# EAGLE design SOS (EAGLE 9.6.2)
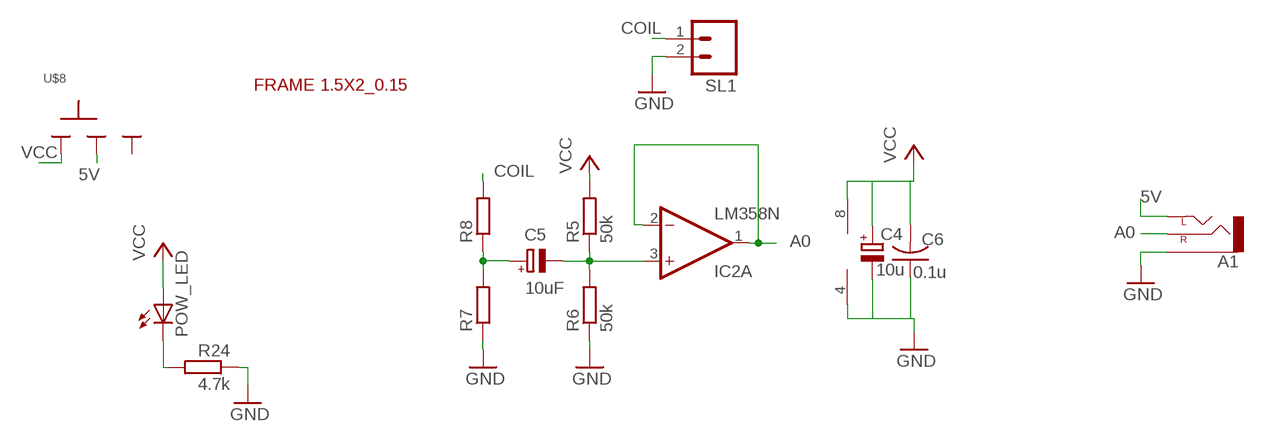
[diagram p0: schematic, sheet 1]

## Parts
A1  AUDIO-JACKPTH  [AUDIO-JACK]
C4  10u  CPOL-EUE2.5-5  [E2,5-5]
C5  10uF  CPOL-EUE2.5-6  [E2,5-6]
C6  0.1u  C-US025-024X044  [C025-024X044]
IC2  LM358N  [DIL08]
POW_LED  LED3MM  [LED3MM]
R5  50k  R-EU_0204/7  [0204/7]
R6  50k  R-EU_0204/7  [0204/7]
R7  R-EU_0204/7  [0204/7]
R8  R-EU_0204/7  [0204/7]
R24  4.7k  R-EU_0204/7  [0204/7]
SL1  M02  [02P]
U$1  FRAME_1.5X2_RAD_0.15  [FRAME_1.5X2_RAD_0.15]
U$8  SLIDESWITCH-BIG  [BIGSWITCH]

## Nets
5V: A1.TIP(LEFT) U$8.2
A0: A1.RING(RIGHT) IC2.1(A:OUT) IC2.2(A:-IN)
CLAMP_SIGNAL: C5.- IC2.3(A:+IN) R5.1 R6.2
COIL: R8.2 SL1.1
GND: A1.SLEEVE C4.- C6.1 IC2.4(P:V-) R6.1 R7.1 R24.1 SL1.2
N$1: C5.+ R7.2 R8.1
N$8: POW_LED.K(C) R24.2
VCC: C4.+ C6.2 IC2.8(P:V+) POW_LED.A R5.2 U$8.1
Unconnected: IC2.5(B:+IN) IC2.6(B:-IN) IC2.7(B:OUT) U$8.3

## Library data of the parts
A1 = CEDT_JANUARY_2015_v6:AUDIO-JACK: 3.5mm Audio Jack Simple 3.5mm common PCB mount audio jack. SKU: PRT-08032
C4 C5 = rcl:CPOL-EU: POLARIZED CAPACITOR, European symbol; SPICEPREFIX: C
C6 = rcl:C-US: CAPACITOR, American symbol; SPICEPREFIX: C
IC2 = CEDT_JANUARY_2015_v5:LM358: OP AMP also LM158; LM258; LM2904 Source: http://cache.national.com/ds/LM/LM158.pdf
POW_LED = CEDT_JANUARY_2015_v6:LED
R5-R8 R24 = rcl:R-EU_: RESISTOR, European symbol; SPICEPREFIX: R
SL1 = CEDT_JANUARY_2015_v6:M02: AMP QUICK CONNECTOR
U$1 = CEDT_JANUARY_2015_v6:FRAME_1.5X2_RAD_0.15
U$8 = CEDT_JANUARY_2015_v6:SLIDESWITCH

## Board
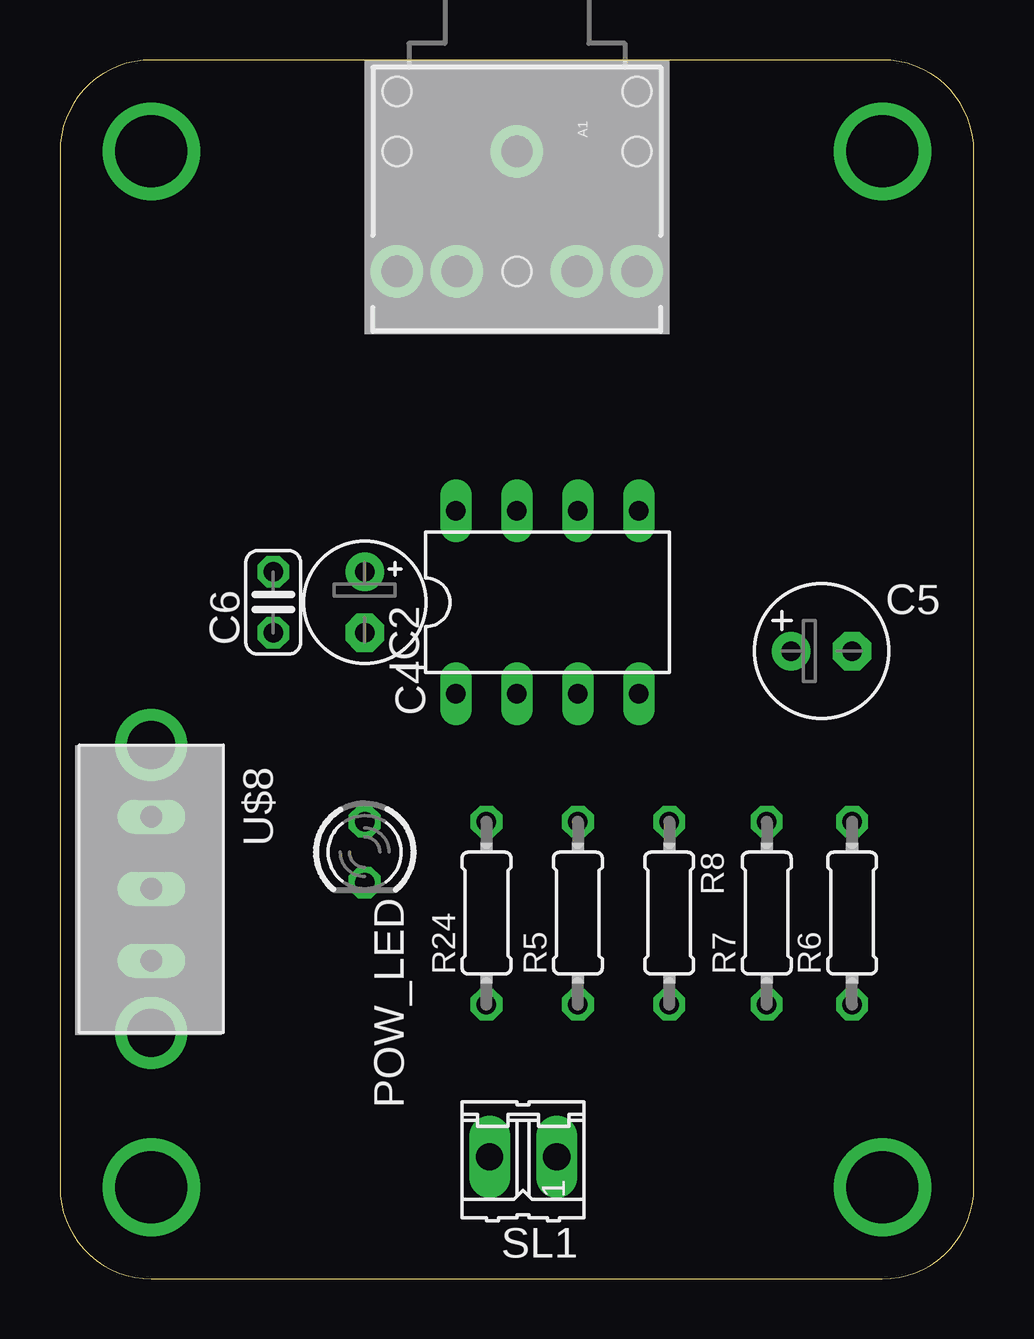
[diagram p1: board, top side]
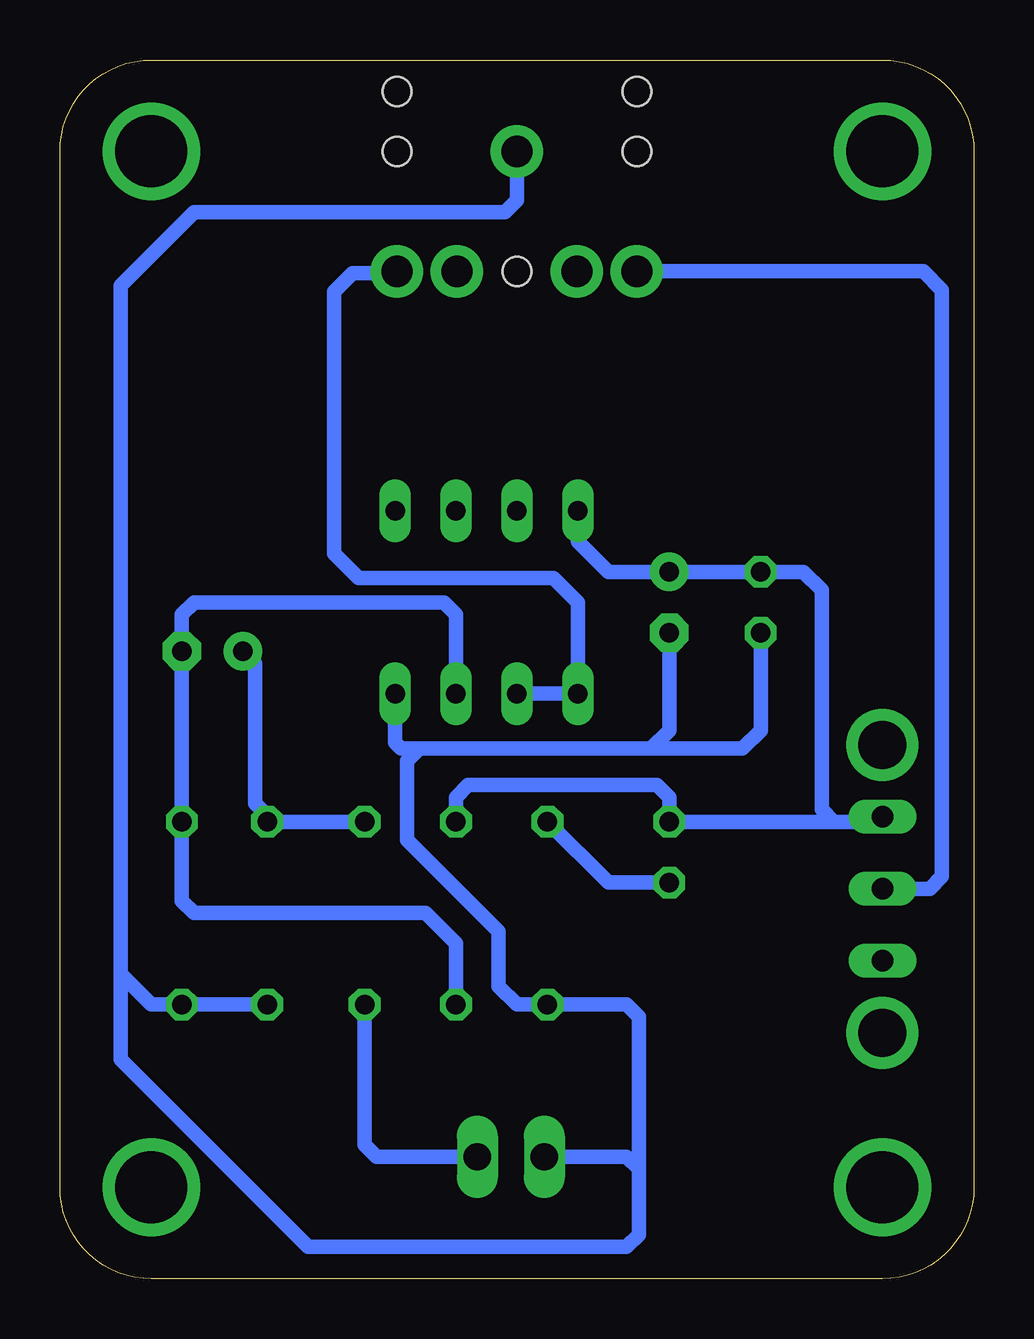
[diagram p2: board, bottom side, seen from below]

Size 38.1 x 50.8 mm. Coordinates in mm from the lower left corner, seen from the top.
Copper layers (1*16): Top 0.035mm / dielectric 1.5mm / Bottom 0.035mm
Design rules "default *": minimum track width 6mil, minimum drill 0.35mm, track to track 16mil, track to pad 16mil, pad to pad 16mil, via to via 16mil, smd to smd 16mil, copper to edge 40mil, drill to drill 6mil, minimum pad ring 10mil, minimum via ring 8mil, stop-mask expansion 4mil, vias tented up to drill 0mil, thermal gap 10mil

### Footprints (pad centres in the part's own frame; a part is rotated, then mirrored left to right if it is on the bottom)
AUDIO-JACK = drill 1.3 pad 2.184: RING 5,5; RSH 5,2.5; SLEEVE 0,0; TIP 5,-5; TSH 5,-2.5 | hole 1.2: 0,5; -2.5,5; -2.5,-5; 0,-5; 5,0
E2,5-5 = drill 0.813 pad 1.6: + -1.27,0 | drill 0.813 pad 1.6 octagon: - 1.27,0
E2,5-6 = drill 0.813 pad 1.6: + -1.27,0 | drill 0.813 pad 1.6 octagon: - 1.27,0
C025-024X044 = drill 0.813 octagon: 1 -1.27,0; 2 1.27,0
DIL08 = drill 0.813 long: 1 -3.81,-3.81; 2 -1.27,-3.81; 3 1.27,-3.81; 4 3.81,-3.81; 5 3.81,3.81; 6 1.27,3.81; 7 -1.27,3.81; 8 -3.81,3.81
LED3MM = drill 0.813 octagon: A -1.27,0; K 1.27,0
0204/7 = drill 0.813 octagon: 1 -3.81,0; 2 3.81,0
02P = drill 1.143 long: 1 -1.397,0; 2 1.397,0
FRAME_1.5X2_RAD_0.15 = drill 2.997 pad 4.064: P$1 3.81,46.99; P$2 34.29,46.99; P$3 34.29,3.81; P$4 3.81,3.81
BIGSWITCH = drill 0.9 long: 1 -3,0; 2 0,0; 3 3,0 | drill 2 pad 2.184: TAB1 -6,0; TAB2 6,0

### Placement (x,y rotation side)
A1  19.05,46.99 270 top
C4  12.7,28.19 270 top
C5  31.75,26.16 0 top
C6  8.89,28.19 90 top
IC2  20.32,28.19 0 top
POW_LED  12.7,17.78 270 top
R5  21.59,15.24 90 top
R6  33.02,15.24 90 top
R7  29.46,15.24 90 top
R8  25.4,15.24 270 top
R24  17.78,15.24 90 top
SL1  19.3,5.08 180 top
U$1  0,0 0 top
U$8  3.81,16.26 270 top

### Tracks (layer width: path | path; a pad name or v marks a point on that pad's centre or on a via)
5V
  Bottom 0.61: U$8.2 1.84,16.26 1.33,16.76 1.33,41.21 2.11,41.99 A1.TIP
A0
  Bottom 0.61: A1.RING 24.13,41.91 25.91,41.91 26.67,41.15 26.67,30.23 25.65,29.21 17.53,29.21 16.51,28.19 IC2.1 IC2.2
CLAMP_SIGNAL
  Bottom 0.61: R5.1 21.59,13.97 22.86,15.24 32.51,15.24 33.02,15.75 R6.2 C5.- 33.02,27.69 32.51,28.19 22.1,28.19 21.59,27.69 IC2.3
COIL
  Bottom 0.61: R8.2 25.4,5.59 24.89,5.08 SL1.1
GND
  Bottom 0.61: R7.1 R6.1 34.29,11.43 35.56,12.7 | A1.SLEEVE 19.05,44.96 19.56,44.45 32.51,44.45 35.56,41.4 35.56,12.7 | 35.56,12.7 35.56,9.14 27.75,1.33 14.48,1.33 13.97,1.84 13.97,4.57 | 13.97,4.57 13.97,10.92 14.48,11.43 R24.1 19.05,11.43 19.81,12.19 19.81,14.48 23.62,18.29 23.62,21.59 23.11,22.1 | SL1.2 14.48,5.08 13.97,4.57 | IC2.4 24.13,22.35 23.88,22.1 23.11,22.1 | C6.1 8.89,22.86 9.65,22.1 13.46,22.1 | 23.11,22.1 13.46,22.1 | C4.- 12.7,22.86 13.46,22.1
N$1
  Bottom 0.61: R8.1 29.21,19.05 | 29.21,19.05 R7.2 | 29.21,19.05 29.97,19.81 29.97,25.65 C5.+
N$8
  Bottom 0.61: R24.2 15.24,16.51 POW_LED.K
VCC
  Bottom 0.61: U$8.1 4.02,19.05 5.84,19.05 | 5.84,19.05 POW_LED.A 12.7,20.07 13.21,20.57 21.08,20.57 21.59,20.07 R5.2 | IC2.8 16.51,30.73 15.24,29.46 C4.+ C6.2 7.11,29.46 6.35,28.7 6.35,19.56 5.84,19.05